# EAGLE design Simple-Fet -v016-pro-mini (EAGLE 7.6.0)
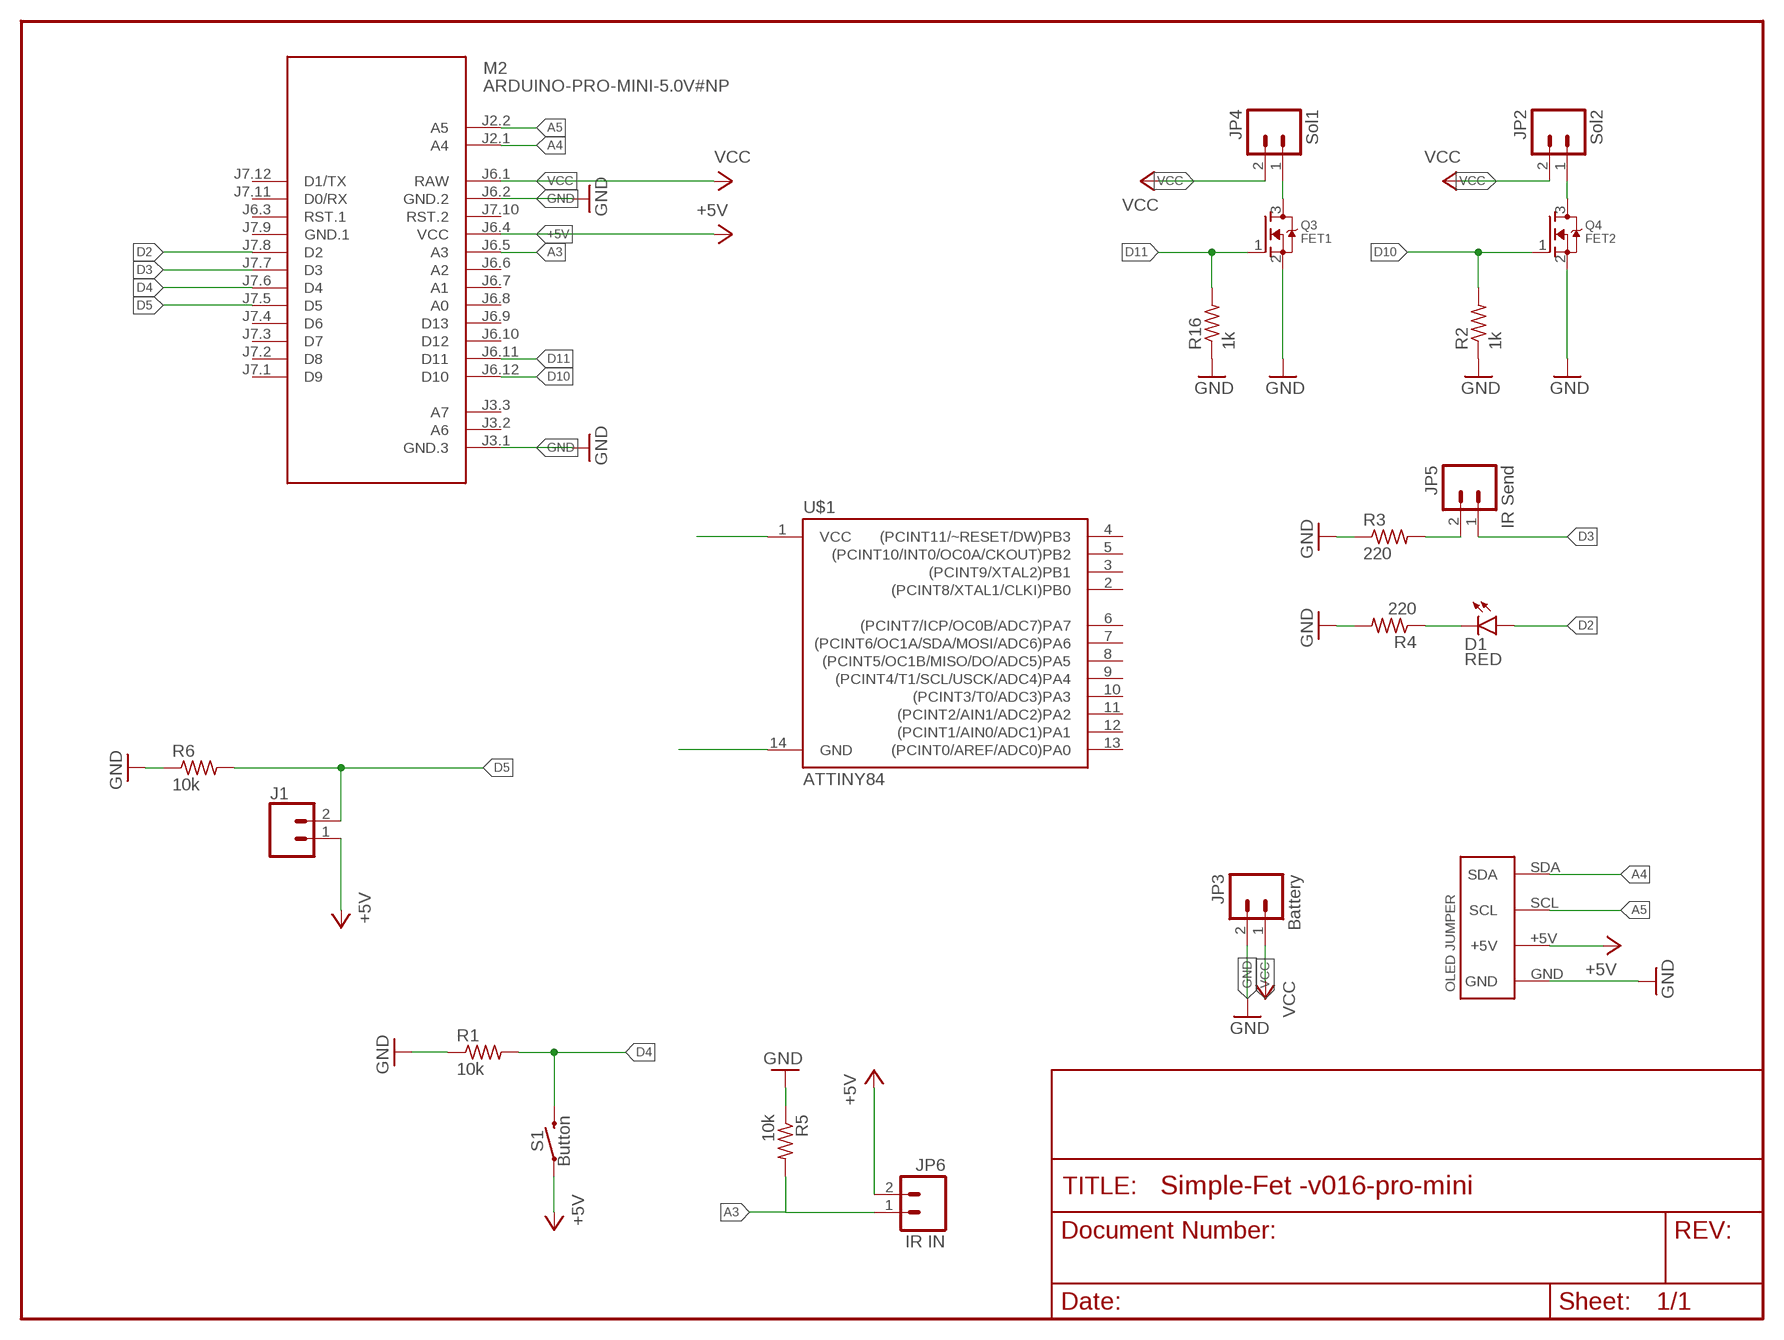
[diagram p0: schematic, sheet 1]

## Parts
D1  RED  LED-RED1206  [LED-1206]
J1  CONN_02POGO_PIN_HOLES_ONLY  [1X02_PP_HOLES_ONLY]
JP2  Sol2  M02PTH  [1X02]
JP3  Battery  M02PTH  [1X02]
JP4  Sol1  M02PTH  [1X02]
JP5  IR Send  M02PTH  [1X02]
JP6  IR IN  M02PTH  [1X02]
M2  ARDUINO-PRO-MINI-5.0V#NP  [ARDUINO-PRO-MINI#NP]
Q3  FET1  MOSFET-NREFLOW  [SOT23]
Q4  FET2  MOSFET-NREFLOW  [SOT23]
R1  10k  R-US_M1206  [M1206]
R2  1k  R-US_M1206  [M1206]
R3  220  R-US_M1206  [M1206]
R4  220  R-US_M1206  [M1206]
R5  10k  R-US_M1206  [M1206]
R6  10k  R-US_M1206  [M1206]
R16  1k  R-US_M1206  [M1206]
S1  Button  MOMENTARY-SWITCH-SPST-SMD-6.0X3.5MM  [TACTILE_SWITCH_SMD_6.0X3.5MM]
U$1  ATTINY84  [SO14]
U$2  OLEDHEADER  [OLED-CON]

## Nets
+5V [+5V]: J1.1 JP6.2 M2.J6.4(VCC) S1.1 U$2.+5V
A3: JP6.1 M2.J6.5(A3) R5.2
A4: M2.J2.1(A4) U$2.SDA
A5: M2.J2.2(A5) U$2.SCL
D2: D1.A M2.J7.8(D2)
D3: JP5.1 M2.J7.7(D3)
D4: M2.J7.6(D4) R1.2 S1.2
D5: J1.2 M2.J7.5(D5) R6.2
D10: M2.J6.12(D10) Q4.1(G) R2.2
D11: M2.J6.11(D11) Q3.1(G) R16.2
GND: JP3.2 M2.J3.1(GND.3) M2.J6.2(GND.2) Q3.2(S) Q4.2(S) R1.1 R2.1 R3.1 R4.2 R5.1 R6.1 R16.1 U$2.GND
M1 [M2]: JP4.1 Q3.3(D)
M2 [M1]: JP2.1 Q4.3(D)
N$1: U$1.1(VCC)
N$2: U$1.14(GND)
N$5: D1.C R4.1
N$10: JP5.2 R3.2
VCC [VCC]: JP2.2 JP3.1 JP4.2 M2.J6.1(RAW)
Unconnected: M2.J3.2(A6) M2.J3.3(A7) M2.J6.3(RST.1) M2.J6.6(A2) M2.J6.7(A1) M2.J6.8(A0) M2.J6.9(D13) M2.J6.10(D12) M2.J7.1(D9) M2.J7.2(D8) M2.J7.3(D7) M2.J7.4(D6) M2.J7.10(RST.2) M2.J7.11(D0/RX) M2.J7.12(D1/TX) U$1.2((PCINT8/XTAL1/CLKI)PB0) U$1.3((PCINT9/XTAL2)PB1) U$1.4((PCINT11/~RESET/DW)PB3) U$1.5((PCINT10/INT0/OC0A/CKOUT)PB2) U$1.6((PCINT7/ICP/OC0B/ADC7)PA7) U$1.7((PCINT6/OC1A/SDA/MOSI/ADC6)PA6) U$1.8((PCINT5/OC1B/MISO/DO/ADC5)PA5) U$1.9((PCINT4/T1/SCL/USCK/ADC4)PA4) U$1.10((PCINT3/T0/ADC3)PA3) U$1.11((PCINT2/AIN1/ADC2)PA2) U$1.12((PCINT1/AIN0/ADC1)PA1) U$1.13((PCINT0/AREF/ADC0)PA0)

## Power pins joined to a net without a drawn wire
GND.1: M2.J7.9(GND.1)

## Library data of the parts
D1 = SparkFun-LED:LED-RED: Assorted Red LEDs LilyPad 1206- DIO-09912 1206- DIO-00809 0603- DIO-00819 "SMART" means more efficient and expensive; MPN: HSMC-C150; OC_NEWARK: 05M0343; PROD_ID: DIO-09912
J1 = SparkFun-Connectors:CONN_02: Multi connection point. Often used as Generic Header-pin footprint for 0.1 inch spaced/style header connections On any of the 0.1 inch spaced packages, you can populate with these: Break Away Headers - Straight <https://www.sparkfun.com/products/116> (PRT-00116) Break Away Male Headers - Right Angle <https://www.sparkfun.com/products/553> (PRT-00553) Female Headers <https://www.sparkfun.com/products/115> (PRT-00115) Break Away Headers - Machine Pin <https://www.sparkfun.com/products/117> (PRT-00117) Break Away Female Headers - Swiss Machine Pin <https://www.sparkfun.com/products/743> (PRT-00743) For SCREWTERMINALS and SPRING TERMINALS visit here: Screw Terimnals on SparkFun.com <https://www.sparkfun.com/search/results?term=Screw+Terminals> (5mm/3.5mm/2.54mm spacing) This device is also useful as a general connection point to wire up your design to another part of your project. Our various solder wires solder well into these plated through hole pads. Hook-Up Wire - Assortment (Stranded, 22 AWG) <https://www.sparkfun.com/products/11375> (PRT-11375) Hook-Up Wire - Assortment (Solid Core, 22 AWG) <https://www.sparkfun.com/products/11367> (PRT-11367) View the entire wire category on our website here <https://www.sparkfun.com/categories/141> Special notes: Molex polarized connector foot print use with: PRT-08233 with associated crimp pins and housings. 2.54_SCREWTERM for use with PRT-10571. 3.5mm Screw Terminal footprints for PRT-08084 5mm Screw Terminal footprints for use with PRT-08432
JP2 JP4 = SparkFun:M02: Header 2 Standard 2-pin 0.1" header. Use with straight break away headers (SKU : PRT-00116), right angle break away headers (PRT-00553), swiss pins (PRT-00743), machine pins (PRT-00117), and female headers (PRT-00115). Molex polarized connector foot print use with SKU : PRT-08233 with associated crimp pins and housings.; MF: MOLEX; MPN: 22-23-2021; OC_NEWARK: 25C3832
JP3 = SparkFun:M02: Header 2 Standard 2-pin 0.1" header. Use with straight break away headers (SKU : PRT-00116), right angle break away headers (PRT-00553), swiss pins (PRT-00743), machine pins (PRT-00117), and female headers (PRT-00115). Molex polarized connector foot print use with SKU : PRT-08233 with associated crimp pins and housings.; MF: KEYSTONE ELECTR; MPN: 2239; OC_NEWARK: 59K0357
JP5 = SparkFun:M02: Header 2 Standard 2-pin 0.1" header. Use with straight break away headers (SKU : PRT-00116), right angle break away headers (PRT-00553), swiss pins (PRT-00743), machine pins (PRT-00117), and female headers (PRT-00115). Molex polarized connector foot print use with SKU : PRT-08233 with associated crimp pins and housings.; MF: FAIRCHILD SEMICONDUCTOR; MPN: QEE122; OC_NEWARK: 83C0473
JP6 = SparkFun:M02: Header 2 Standard 2-pin 0.1" header. Use with straight break away headers (SKU : PRT-00116), right angle break away headers (PRT-00553), swiss pins (PRT-00743), machine pins (PRT-00117), and female headers (PRT-00115). Molex polarized connector foot print use with SKU : PRT-08233 with associated crimp pins and housings.; MF: FAIRCHILD SEMICONDUCTOR; MPN: QEE113; OC_NEWARK: 78K6116
M2 = Simple-Fet -v015-pro-mini:ARDUINO-PRO-MINI-*#NP: Arduino Pro Mini (and compatible devices) without programming pads More details available here: https://www.arduino.cc/en/Main/ArduinoBoardProMini Click here to find device on ebay.com <http://www.ebay.com/sch/arduino+pro+mini>
Q3 Q4 = adafruit:MOSFET-N: N-Channel Mosfet 2N7002E - 60V 260mA SOT23 [Digikey: 2N7002ET1GOSTR-ND] - REEL BSH103 - 30V 850mA SOT23 [Digikey: 568-5013-1-ND]; MPN: SI2392ADS-T1-GE3; OC_NEWARK: 01AC4985
R1 R5 R6 = resistor:R-US_: RESISTOR, American symbol; MPN: MC1206S4F1002T5E; OC_NEWARK: 79M6135
R2 R16 = resistor:R-US_: RESISTOR, American symbol; MPN: RT1206FRE071KL; OC_NEWARK: 66R9771
R3 R4 = resistor:R-US_: RESISTOR, American symbol; MF: BOURNS, INC.; MPN: CR1206FX2200ELF; OC_NEWARK: 01J3162
S1 = SparkFun-Switches:MOMENTARY-SWITCH-SPST: Momentary Switch (Pushbutton) - SPST Normally-open (NO) SPST momentary switches (buttons, pushbuttons). Variants PTH-12MM - 12mm square, through-hole Momentary Pushbutton Switch - 12mm Square <https://www.sparkfun.com/products/9190> (COM-09190) PTH-6.0MM, PTH-6.0MM-KIT - 6.0mm square, through-hole Mini Pushbutton Switch <https://www.sparkfun.com/products/97> (COM-00097) KIT package intended for soldering kit's - only one side of pads' copper is exposed. PTH-RIGHT-ANGLE-KIT - Right-angle, through-hole Right Angle Tactile Button <https://www.sparkfun.com/products/10791> - Used on SparkFun BigTime Watch Kit <https://www.sparkfun.com/products/11734> SMD-12MM - 12mm square, surface-mount Tactile Button - SMD (12mm) <https://www.sparkfun.com/products/12993> (COM-12993) Used on SparkFun PicoBoard <https://www.sparkfun.com/products/11888> SMD-4.5MM - 4.5mm Square Trackball Switch Used on SparkFun Blackberry Trackballer Breakout <https://www.sparkfun.com/products/13169> SMD-4.6MMX2.8MM - 4.60mm x 2.80mm, surface mount Used on SparkFun SAMD21 Mini Breakout <https://www.sparkfun.com/products/13664> SMD-5.2MM, SMD-5.2-REDUNDANT - 5.2mm square, surface-mount Mini Pushbutton Switch - SMD <https://www.sparkfun.com/products/8720> (COM-08720) Used on Arduino Pro Mini <https://www.sparkfun.com/products/11114> REDUNDANT package connects both switch circuits together SMD-6.0X3.5MM - 6.0 x 3.5mm, surface mount Momentary Reset Switch SMD <https://www.sparkfun.com/products/8229> (COM-08229) SMD-6.2MM-TALL - 6.2mm square, surface mount Tactile Button - SMD (6mm) <https://www.sparkfun.com/products/12992> Used on SparkFun Digital Sandbox <https://www.sparkfun.com/products/12651> SMD-RIGHT-ANGLE - Right-angle, surface mount Used on SparkFun Block for Intel® Edison - Arduino <https://www.sparkfun.com/products/13036>; OC_NEWARK: unknown; PROD_ID: SWCH-00815; SF_SKU: COM-08229
U$1 = SparkFun-IC-Microcontroller:ATTINY84: Atmel 14-pin 2/4/8kB flash uC Datasheet <https://cdn.sparkfun.com/datasheets/Widgets/doc8006.pdf> SparkFun Products Tiny AVR Programmer <https://www.sparkfun.com/products/11801> (PGM-11801) SparkFun Servo Trigger - Continuous Rotation <https://www.sparkfun.com/products/13872> (WIG-13872) SparkFun Servo Trigger <https://www.sparkfun.com/products/13118> (WIG-13118); PROD_ID: IC-11285
U$2 = solenoid:OLEDHEADER

## Net classes
0 default: width 0.381 mm
1 VCC: width 0.508 mm
2 +5V: width 0.508 mm
3 N$2: width 0.381 mm
4 N$3: width 0.381 mm
5 GND: width 0.381 mm
6 M1: width 0.381 mm
7 M2: width 0.381 mm

## Board
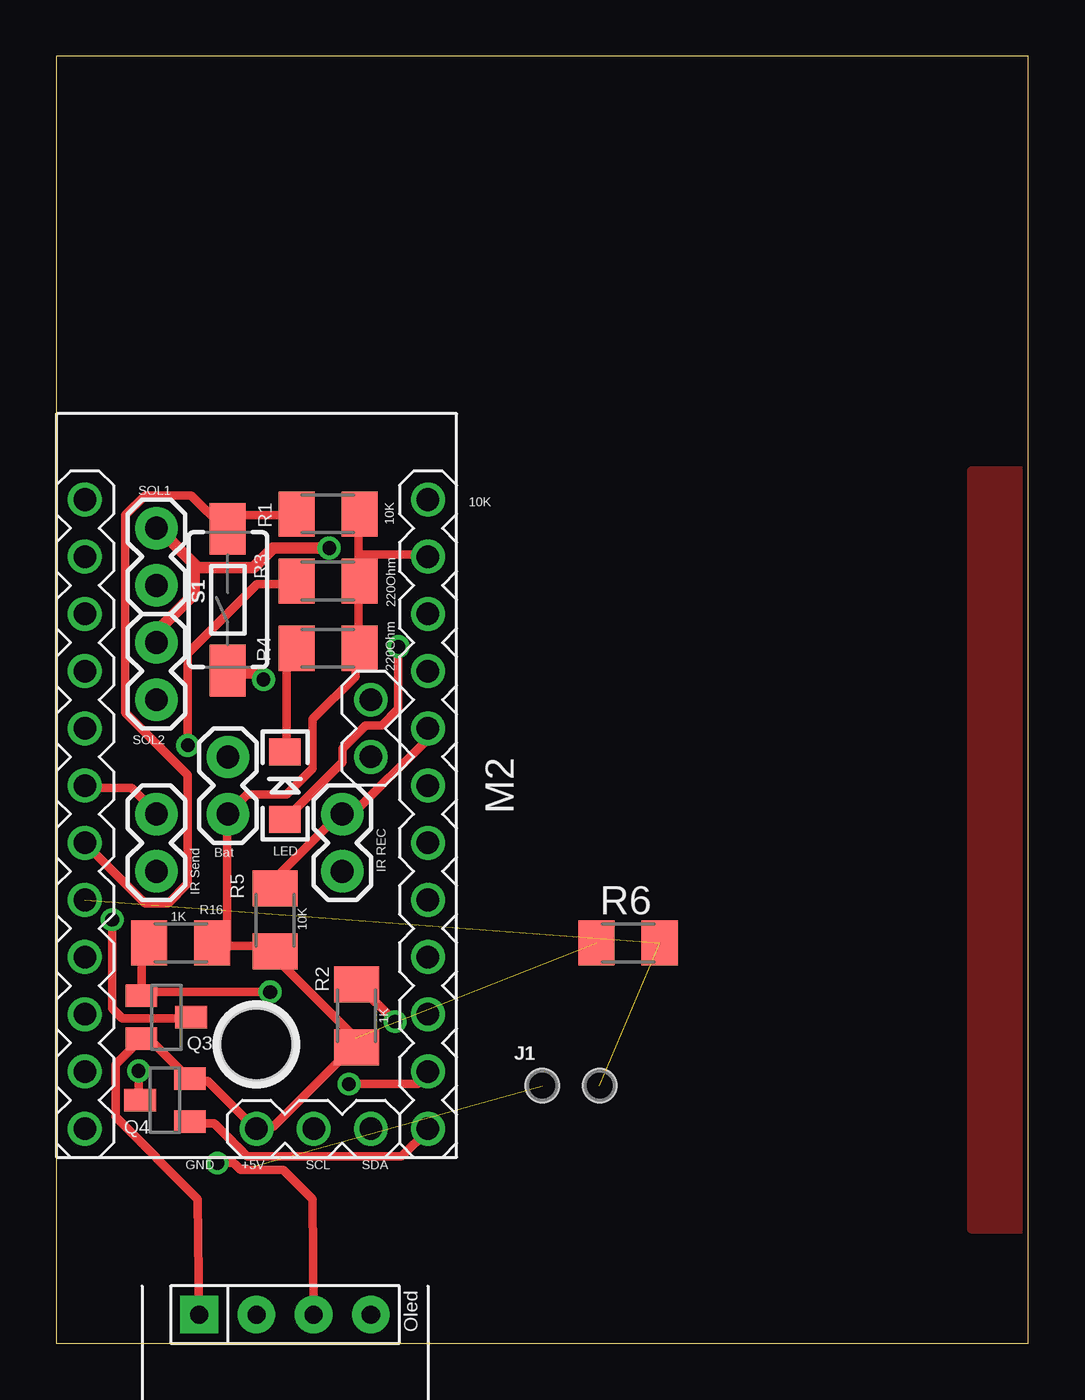
[diagram p1: board, top side]
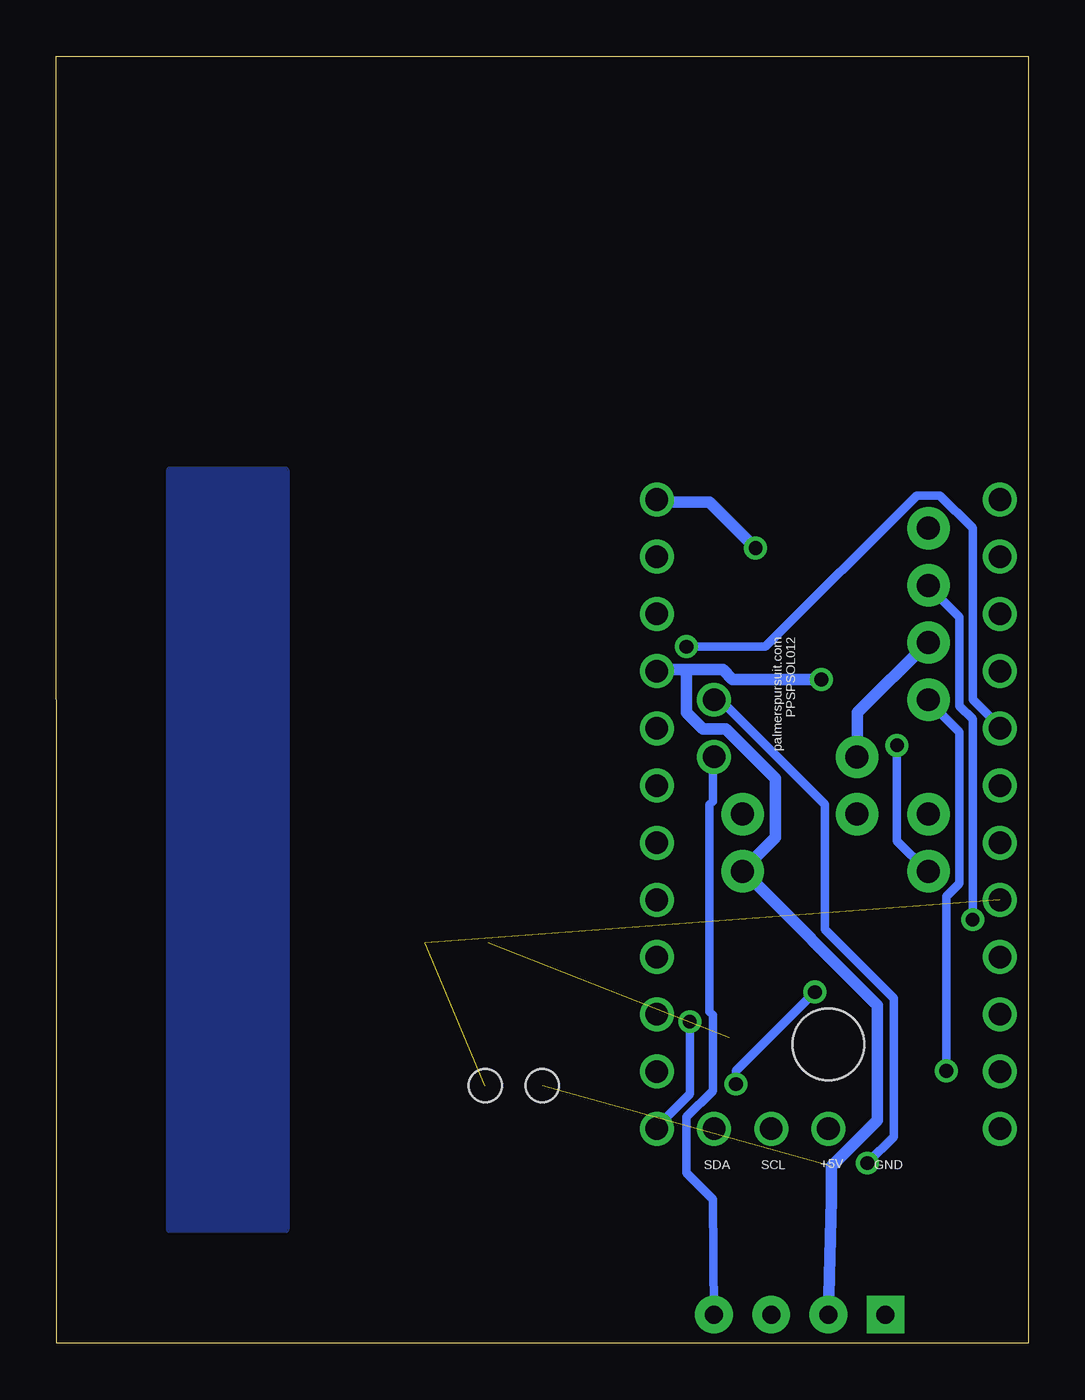
[diagram p2: board, bottom side, seen from below]

Size 43.18 x 57.15 mm. Coordinates in mm from the lower left corner, seen from the top.
Outline: 0,0 43.16,0 43.18,57.15 0,57.15 0,0
Copper layers (1*16): Top 0.035mm / dielectric 1.5mm / Bottom 0.035mm
Design rules "default *": minimum track width 12mil, minimum drill 24mil, track to track 8mil, track to pad 8mil, pad to pad 8mil, via to via 8mil, smd to smd 8mil, copper to edge 10mil, drill to drill 15mil, minimum pad ring 10mil, minimum via ring 8mil, stop-mask expansion 4mil, vias tented up to drill 999mil, thermal gap 10mil
Holes 3.2 mm at 8.89,13.27

### Footprints (pad centres in the part's own frame; a part is rotated, then mirrored left to right if it is on the bottom)
LED-1206 = smd 1.2 x 1.4: A -1.5,0; C 1.5,0
1X02_PP_HOLES_ONLY = drill 0.889 pad 0.813: 1 0,0; 2 2.54,0 | hole 1.473: 0,0; 2.54,0
1X02 = drill 1.016 pad 1.88: 1 0,0; 2 2.54,0
ARDUINO-PRO-MINI#NP = drill 1: J2.1 -1.27,5.08; J2.2 -3.81,5.08; J3.1 15.24,0; J3.2 15.24,2.54; J3.3 15.24,5.08; J6.1 -12.7,7.62; J6.2 -10.16,7.62; J6.3 -7.62,7.62; J6.4 -5.08,7.62; J6.5 -2.54,7.62; J6.6 0,7.62; J6.7 2.54,7.62; J6.8 5.08,7.62; J6.9 7.62,7.62; J6.10 10.16,7.62; J6.11 12.7,7.62; J6.12 15.24,7.62; J7.1 15.24,-7.62; J7.2 12.7,-7.62; J7.3 10.16,-7.62; J7.4 7.62,-7.62; J7.5 5.08,-7.62; J7.6 2.54,-7.62; J7.7 0,-7.62; J7.8 -2.54,-7.62; J7.9 -5.08,-7.62; J7.10 -7.62,-7.62; J7.11 -10.16,-7.62; J7.12 -12.7,-7.62
SOT23 = smd 1 x 1.4: 1 -0.95,-1.1; 2 0.95,-1.1; 3 0,1.1
M1206 = smd 1.6 x 2: 1 -1.4,0; 2 1.4,0
TACTILE_SWITCH_SMD_6.0X3.5MM = smd 2.3 x 1.6: 1 -3.15,0; 2 3.15,0
SO14 = smd 0.6 x 1.2: 1 -3.175,-2.8; 2 -1.905,-2.8; 3 -0.635,-2.8; 4 0.635,-2.8; 5 1.905,-2.8; 6 3.175,-2.8; 7 4.445,-2.8; 8 4.445,2.8; 9 3.175,2.8; 10 1.905,2.8; 11 0.635,2.8; 12 -0.635,2.8; 13 -1.905,2.8; 14 -3.175,2.8
OLED-CON = drill 0.8 pad 1.676: +5V 0,2.54; SCL 0,5.08; SDA 0,7.62 | drill 0.8 pad 1.676 square: GND 0,0

### Placement (x,y rotation side)
D1  10.16,24.77 90 top
J1  21.59,11.43 0 top
JP2  4.45,28.57 90 top
JP3  7.62,26.04 270 top
JP4  4.45,33.66 90 top
JP5  4.45,23.5 270 top
JP6  12.7,23.5 270 top
M2  8.89,24.77 270 top
Q3  4.89,14.48 270 top
Q4  4.83,10.79 90 top
R1  12.06,36.83 180 top
R2  13.34,14.54 90 top
R3  12.06,33.85 180 top
R4  12.06,30.86 0 top
R5  9.72,18.8 90 top
R6  25.4,17.78 0 top
R16  5.52,17.78 180 top
S1  7.62,33.02 90 top
U$1  2.54,-41.91 0 top  (outside the outline)
U$2  6.35,1.27 270 top

### Tracks (layer width: path | path; a pad name or v marks a point on that pad's centre or on a via)
+5V  (via drill 0.61)  (1 unrouted)
  Top 0.508: v9.2,29.47 8.91,29.76 7.74,29.76 S1.1
  Bottom 0.508: v9.2,29.47 13.14,29.47 13.58,29.91 15.19,29.91 | 15.19,29.91 16.5,29.91 M2.J6.4 | U$2.+5V 8.76,6.39 8.76,7.86 6.72,9.9 6.72,15.01 12.56,20.85 JP6.2 12.56,21.14 11.25,22.46 11.25,25.09 13.44,27.28 14.46,27.28 15.19,28.01 15.19,29.91
A3
  Top 0.381: R5.2 9.79,20.27 9.79,20.71 12.56,23.48 JP6.1 12.85,23.48 13.14,23.48 16.5,26.84 16.5,27.28 M2.J6.5
A4
  Bottom 0.381: M2.J2.1 14.02,25.96 14.02,24.07 14.17,23.92 14.17,14.72 14.02,14.57 14.02,11.21 15.19,10.05 15.19,7.56 14.02,6.39 U$2.SDA
A5  (via drill 0.61)
  Top 0.381: v7.16,8 7.89,8 8.18,7.71 10.08,7.71 11.39,6.39 U$2.SCL
  Bottom 0.381: v7.16,8 5.99,9.17 5.99,15.3 9.05,18.37 9.05,23.92 13.58,28.45 13.88,28.45 M2.J2.2
D2  (via drill 0.61)
  Top 0.381: v15.19,30.93 15.19,28.16 14.46,27.43 13.73,27.43 12.71,26.4 12.71,25.82 10.22,23.34 D1.A
  Bottom 0.381: v15.19,30.93 11.68,30.93 4.97,37.65 3.94,37.65 2.48,36.19 2.48,28.59 1.31,27.43 M2.J7.8
D3
  Top 0.381: M2.J7.7 1.31,24.65 3.36,24.65 4.38,23.63 JP5.1
D4
  Top 0.381: R1.2 10.66,36.77 8.32,36.77 7.74,36.19 S1.2 7.45,36.19 5.99,37.65 3.94,37.65 3.07,36.77 3.07,28.01 5.84,25.23 5.84,20.41 4.97,19.54 3.94,19.54 1.31,22.17 M2.J7.6
D5  (2 unrouted)
D10  (via drill 0.61)
  Top 0.381: Q4.1 5.99,9.75 7.01,9.75 8.47,8.29 15.34,8.29 16.5,9.46 M2.J6.12 | v15.04,14.28 13.44,15.89 R2.2
  Bottom 0.381: v15.04,14.28 15.04,11.07 16.5,9.61 M2.J6.12
D11  (via drill 0.61)
  Top 0.381: R16.2 4.09,17.64 3.8,17.35 3.8,15.45 Q3.1 3.94,15.6 v9.49,15.6 | v13,11.51 16.07,11.51 16.5,11.94 M2.J6.11
  Bottom 0.381: v9.49,15.6 13,12.09 v13,11.51
GND  (1 unrouted)
  Top 0.381: U$2.GND 6.28,6.39 2.63,10.05 2.63,12.38 3.65,13.4 Q3.2 3.8,13.4 4.24,13.4 5.84,11.8 Q4.2 5.99,11.65 6.72,11.65 8.76,9.61 M2.J3.1 9.05,9.61 9.64,9.61 13.14,13.11 R2.1 13.29,13.26 13.29,13.55 9.79,17.06 9.79,17.35 R5.1 9.64,17.49 9.49,17.64 7.01,17.64 R16.1 7.59,17.79 7.59,23.48 JP3.2 7.74,23.63 8.47,24.36 10.22,24.36 11.39,25.53 11.39,27.72 13.29,29.62 13.29,30.79 R4.2 13.44,30.93 13.44,33.71 R3.1 13.44,34 13.44,35.02 | 13.44,35.02 13.44,36.77 R1.1 | 13.44,35.02 16.5,35.02 M2.J6.2
  pour Top: 43.18,38.73 40.64,38.73 40.64,5.08 43.18,5.08
  pour Bottom: 38.1,38.73 33.02,38.73 33.02,5.08 38.1,5.08
M1  (via drill 0.61)
  Top 0.381: v2.48,18.81 2.48,14.87 2.92,14.43 5.99,14.43 Q3.3
  Bottom 0.381: v2.48,18.81 2.48,27.72 3.07,28.3 3.07,32.24 4.38,33.56 JP4.1
M2  (via drill 0.61)
  Top 0.381: v3.65,12.09 3.65,10.92 Q4.3
  Bottom 0.381: v3.65,12.09 3.65,19.83 3.07,20.41 3.07,27.13 4.38,28.45 JP2.1
N$5
  Top 0.381: D1.C 10.22,26.4 10.22,30.35 10.66,30.79 R4.1
N$10  (via drill 0.61)
  Top 0.381: v5.84,26.55 5.84,30.64 8.91,33.71 10.66,33.71 R3.2
  Bottom 0.381: v5.84,26.55 5.84,22.31 4.53,21 JP5.2
VCC  (via drill 0.61)
  Top 0.508: v12.12,35.31 9.64,35.31 8.76,34.44 6.28,34.44 | 6.28,34.44 4.53,36.19 JP4.2 | JP2.2 4.53,31.22 4.53,31.66 6.13,33.27 6.13,34.29 6.28,34.44
  Bottom 0.508: v12.12,35.31 14.17,37.36 16.5,37.36 M2.J6.1 | JP3.1 7.59,26.11 7.59,28.01 4.53,31.08 JP2.2

### Text on the board
tPlace: SOL1 | 10K | 10K | 220Ohm | 220Ohm | SOL2 | IR REC | Bat | LED | IR Send | 1K | 10K | 1K | GND | +5V | SCL | SDA
bPlace: palmerspursuit.com / PPSPSOL012 | GND | +5V | SCL | SDA